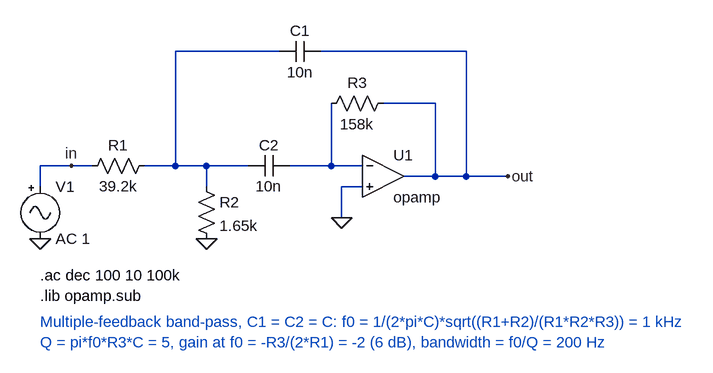
[diagram p0: schematic mfb_bandpass.asc]
mfb_bandpass.asc, the LTspice schematic file:
Version 4
SHEET 1 880 680
WIRE 240 -32 240 144
WIRE 400 -32 240 -32
WIRE 688 -32 464 -32
WIRE 688 160 688 -32
WIRE 480 48 480 144
WIRE 640 48 560 48
WIRE 640 160 640 48
WIRE 32 144 32 176
WIRE 112 144 32 144
WIRE 352 144 192 144
WIRE 288 176 288 144
WIRE 528 144 416 144
WIRE 496 176 528 176
WIRE 496 224 496 176
WIRE 752 160 592 160
FLAG 32 256 0
FLAG 288 256 0
FLAG 496 224 0
FLAG 80 144 in
FLAG 752 160 out
SYMBOL Misc\signal 32 160 R0
SYMATTR InstName V1
SYMATTR Value AC 1
SYMBOL res 208 128 R90
WINDOW 0 0 56 VBottom 2
WINDOW 3 32 56 VTop 2
SYMATTR InstName R1
SYMATTR Value 39.2k
SYMBOL res 272 160 R0
SYMATTR InstName R2
SYMATTR Value 1.65k
SYMBOL cap 416 128 R90
WINDOW 0 0 32 VBottom 2
WINDOW 3 32 32 VTop 2
SYMATTR InstName C2
SYMATTR Value 10n
SYMBOL res 576 32 R90
WINDOW 0 0 56 VBottom 2
WINDOW 3 32 56 VTop 2
SYMATTR InstName R3
SYMATTR Value 158k
SYMBOL cap 464 -48 R90
WINDOW 0 0 32 VBottom 2
WINDOW 3 32 32 VTop 2
SYMATTR InstName C1
SYMATTR Value 10n
SYMBOL OpAmps\opamp 560 96 R0
SYMATTR InstName U1
TEXT 32 312 Left 2 !.ac dec 100 10 100k
TEXT 32 344 Left 2 !.lib opamp.sub
TEXT 32 384 Left 2 ;Multiple-feedback band-pass, C1 = C2 = C: f0 = 1/(2*pi*C)*sqrt((R1+R2)/(R1*R2*R3)) = 1 kHz\nQ = pi*f0*R3*C = 5, gain at f0 = -R3/(2*R1) = -2 (6 dB), bandwidth = f0/Q = 200 Hz

The netlist it stands for:
* mfb_bandpass.asc
V1 in 0 AC 1
R1 N001 in 39.2k
R2 N001 0 1.65k
C2 N002 N001 10n
R3 out N002 158k
C1 out N001 10n
XU1 N002 0 out opamp Aol=100K GBW=10Meg  ; pins invin noninvin out
.ac dec 100 10 100k
.lib opamp.sub
* Multiple-feedback band-pass, C1 = C2 = C: f0 = 1/(2*pi*C)*sqrt((R1+R2)/(R1*R2*R3)) = 1 kHz
* Q = pi*f0*R3*C = 5, gain at f0 = -R3/(2*R1) = -2 (6 dB), bandwidth = f0/Q = 200 Hz
.backanno
.end